# EAGLE schematic wiring-diagram (EAGLE 9.6.2)
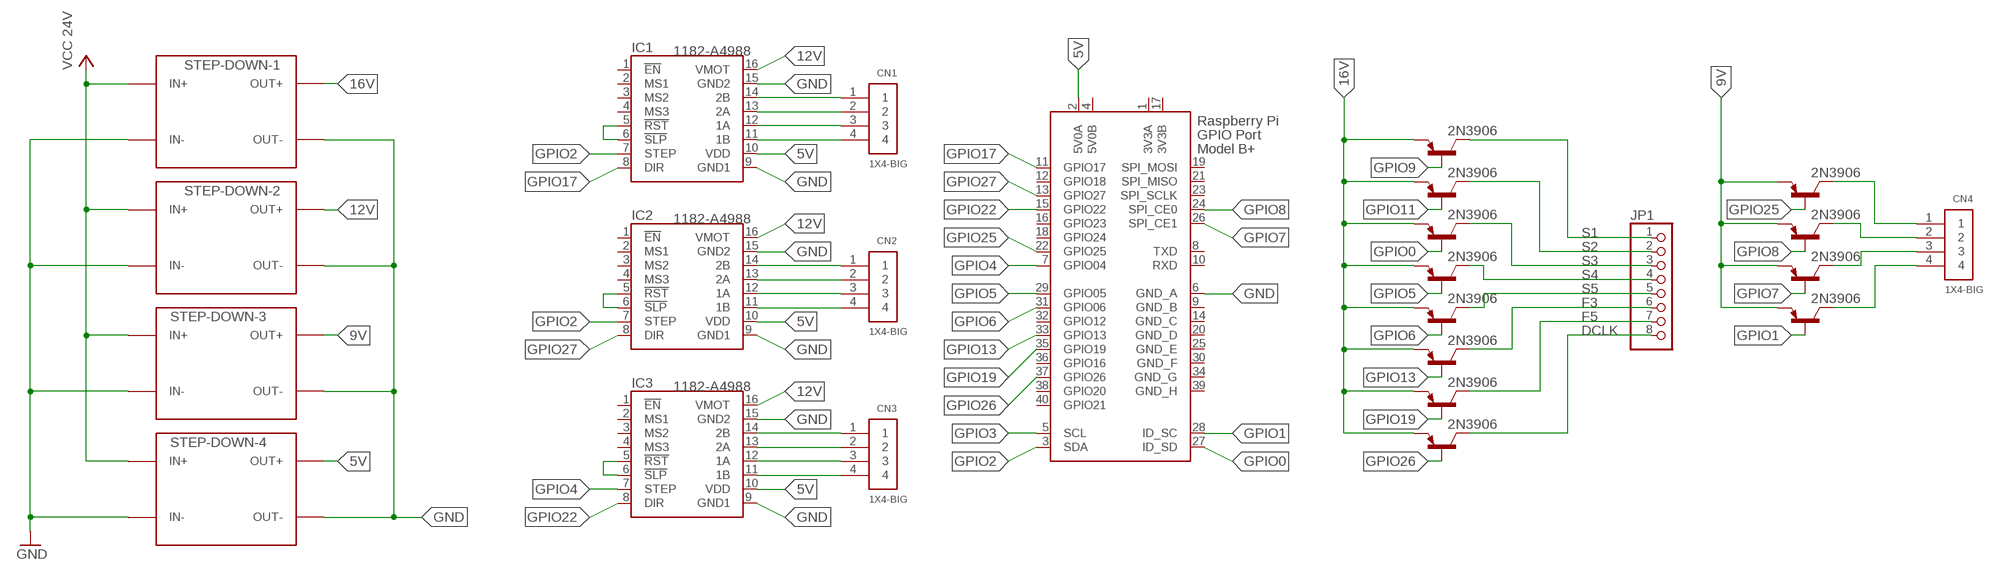
[diagram p0: schematic, sheet 1]

## Parts
CN1  1X4-BIG  [1X04-BIG]
CN2  1X4-BIG  [1X04-BIG]
CN3  1X4-BIG  [1X04-BIG]
CN4  1X4-BIG  [1X04-BIG]
IC1  1182-A4988  [A4988]
IC2  1182-A4988  [A4988]
IC3  1182-A4988  [A4988]
JP1  PINHD-1X8BIG  [1X08-BIG]
Q1  2N3906  [TO92]
Q2  2N3906  [TO92]
Q3  2N3906  [TO92]
Q4  2N3906  [TO92]
Q5  2N3906  [TO92]
Q6  2N3906  [TO92]
Q7  2N3906  [TO92]
Q8  2N3906  [TO92]
Q9  2N3906  [TO92]
Q10  2N3906  [TO92]
Q11  2N3906  [TO92]
Q12  2N3906  [TO92]
STEP-DOWN-1  DC-DC-STEP-DOWN-LM2596  [DC-DC-STEP-DOWN-LM2596]
STEP-DOWN-2  DC-DC-STEP-DOWN-LM2596  [DC-DC-STEP-DOWN-LM2596]
STEP-DOWN-3  DC-DC-STEP-DOWN-LM2596  [DC-DC-STEP-DOWN-LM2596]
STEP-DOWN-4  DC-DC-STEP-DOWN-LM2596  [DC-DC-STEP-DOWN-LM2596]
X5  RASPI_GPIO_B+#_PIN  [RASPI_GPIO_B+_PIN]

## Nets
5V: IC1.10(VDD) IC2.10(VDD) IC3.10(VDD) STEP-DOWN-4.OUT+ X5.2(5V0A)
9V: Q9.3(E) Q10.3(E) Q11.3(E) Q12.3(E) STEP-DOWN-3.OUT+
12V: IC1.16(VMOT) IC2.16(VMOT) IC3.16(VMOT) STEP-DOWN-2.OUT+
16V: Q1.3(E) Q2.3(E) Q3.3(E) Q4.3(E) Q5.3(E) Q6.3(E) Q7.3(E) Q8.3(E) STEP-DOWN-1.OUT+
DCLK: JP1.8 Q8.1(C)
F3: JP1.6 Q6.1(C)
F5: JP1.7 Q7.1(C)
GND: IC1.9(GND1) IC1.15(GND2) IC2.9(GND1) IC2.15(GND2) IC3.9(GND1) IC3.15(GND2) STEP-DOWN-1.IN- STEP-DOWN-1.OUT- STEP-DOWN-2.IN- STEP-DOWN-2.OUT- STEP-DOWN-3.IN- STEP-DOWN-3.OUT- STEP-DOWN-4.IN- STEP-DOWN-4.OUT- X5.6(GND_A)
GPIO0: Q3.2(B) X5.27(ID_SD)
GPIO1: Q12.2(B) X5.28(ID_SC)
GPIO2: IC1.7(STEP) IC2.7(STEP) X5.3(SDA)
GPIO3: X5.5(SCL)
GPIO4: IC3.7(STEP) X5.7(GPIO04)
GPIO5: Q4.2(B) X5.29(GPIO05)
GPIO6: Q5.2(B) X5.31(GPIO06)
GPIO7: Q11.2(B) X5.26(SPI_CE1)
GPIO8: Q10.2(B) X5.24(SPI_CE0)
GPIO9: Q1.2(B)
GPIO11: Q2.2(B)
GPIO13: Q6.2(B) X5.33(GPIO13)
GPIO17: IC1.8(DIR) X5.11(GPIO17)
GPIO19: Q7.2(B) X5.35(GPIO19)
GPIO22: IC3.8(DIR) X5.15(GPIO22)
GPIO25: Q9.2(B) X5.22(GPIO25)
GPIO26: Q8.2(B) X5.37(GPIO26)
GPIO27: IC2.8(DIR) X5.13(GPIO27)
N$4: IC1.5(!RST) IC1.6(!SLP)
N$5: IC2.5(!RST) IC2.6(!SLP)
N$8: CN4.2 Q10.1(C)
N$9: CN4.3 Q11.1(C)
N$10: CN4.4 Q12.1(C)
N$11: CN4.1 Q9.1(C)
N$24: IC3.5(!RST) IC3.6(!SLP)
N$27: CN1.1 IC1.14(2B)
N$28: CN1.2 IC1.13(2A)
N$29: CN1.3 IC1.12(1A)
N$30: CN1.4 IC1.11(1B)
N$31: CN2.1 IC2.14(2B)
N$32: CN2.2 IC2.13(2A)
N$33: CN2.3 IC2.12(1A)
N$34: CN2.4 IC2.11(1B)
N$35: CN3.1 IC3.14(2B)
N$36: CN3.2 IC3.13(2A)
N$37: CN3.3 IC3.12(1A)
N$38: CN3.4 IC3.11(1B)
S1: JP1.1 Q1.1(C)
S2: JP1.2 Q2.1(C)
S3: JP1.3 Q3.1(C)
S4: JP1.4 Q4.1(C)
S5: JP1.5 Q5.1(C)
VCC: STEP-DOWN-1.IN+ STEP-DOWN-2.IN+ STEP-DOWN-3.IN+ STEP-DOWN-4.IN+ ; supply symbol labelled VCC 24V
Unconnected: IC1.1(!EN) IC1.2(MS1) IC1.3(MS2) IC1.4(MS3) IC2.1(!EN) IC2.2(MS1) IC2.3(MS2) IC2.4(MS3) IC3.1(!EN) IC3.2(MS1) IC3.3(MS2) IC3.4(MS3) X5.8(TXD) X5.10(RXD) X5.12(GPIO18) X5.16(GPIO23) X5.18(GPIO24) X5.19(SPI_MOSI) X5.21(SPI_MISO) X5.23(SPI_SCLK) X5.32(GPIO12) X5.36(GPIO16) X5.38(GPIO20) X5.40(GPIO21)

## Power pins joined to a net without a drawn wire
3V3A: X5.1(3V3A)
3V3B: X5.17(3V3B)
5V0B: X5.4(5V0B)
GND_B: X5.9(GND_B)
GND_C: X5.14(GND_C)
GND_D: X5.20(GND_D)
GND_E: X5.25(GND_E)
GND_F: X5.30(GND_F)
GND_G: X5.34(GND_G)
GND_H: X5.39(GND_H)

## Library data of the parts
CN1-CN4 = adafruit:1X4: 4-pin connector
IC1-IC3 = pololu-stepper-driver:1182-A4988: A4988 Stepper Motor Driver Carrier #1182 A4988 Stepper Motor Driver Carrier <https://www.pololu.com/product/1182> in Japan, Suzaku Lab. Ltd. <https://suzakugiken.jp/> #1182 A4988ステッピングモータドライバ <https://szc.jp/po1182>
JP1 = adafruit:PINHD-1X8: PIN HEADER
Q1-Q12 = transistor-pnp:2N3906: PNP Transistor
STEP-DOWN-1-STEP-DOWN-4 = diy-modules:DC-DC-STEP-DOWN-LM2596: DC/DC Step-Down Regulator based on LM2596-ADJ chip
X5 = raspberrypi_bastelstube_v13:RASPI_GPIO_B+#: 2x20 header connector, all pins connected